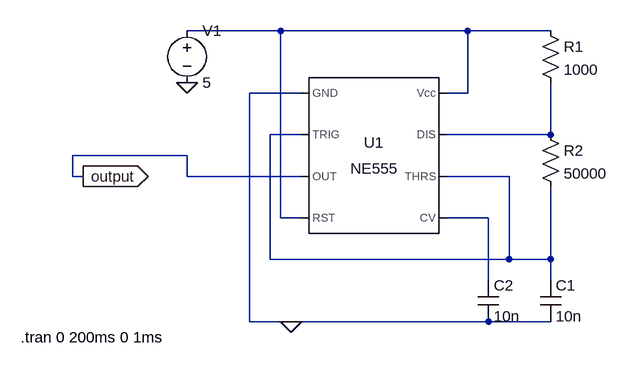
[diagram p0: schematic 1.2.asc]
1.2.asc, the LTspice schematic file:
Version 4
SHEET 1 880 680
WIRE 64 -32 -80 -32
WIRE 352 -32 64 -32
WIRE 480 -32 352 -32
WIRE 96 64 16 64
WIRE 352 64 352 -32
WIRE 352 64 320 64
WIRE 96 128 48 128
WIRE 480 128 480 48
WIRE 480 128 320 128
WIRE -80 160 -256 160
WIRE -256 192 -256 160
WIRE -240 192 -256 192
WIRE -80 192 -80 160
WIRE 96 192 -80 192
WIRE 416 192 320 192
WIRE 64 256 64 -32
WIRE 96 256 64 256
WIRE 384 256 320 256
WIRE 48 320 48 128
WIRE 416 320 416 192
WIRE 416 320 48 320
WIRE 480 320 480 208
WIRE 480 320 416 320
WIRE 384 352 384 256
WIRE 480 352 480 320
WIRE 16 416 16 64
WIRE 80 416 16 416
WIRE 384 416 80 416
WIRE 480 416 384 416
FLAG 80 416 0
FLAG -240 192 output
IOPIN -240 192 Out
FLAG -80 48 0
SYMBOL res 464 -48 R0
SYMATTR InstName R1
SYMATTR Value 1000
SYMBOL res 464 112 R0
SYMATTR InstName R2
SYMATTR Value 50000
SYMBOL cap 464 352 R0
SYMATTR InstName C1
SYMATTR Value 10n
SYMBOL cap 368 352 R0
SYMATTR InstName C2
SYMATTR Value 10n
SYMBOL Misc\\NE555 208 160 R0
SYMATTR InstName U1
SYMBOL voltage -80 -48 R0
SYMATTR InstName V1
SYMATTR Value 5
TEXT -336 440 Left 2 !.tran 0 200ms 0 1ms

The netlist it stands for:
* 1.2.asc
R1 N001 N003 1000
R2 N003 N002 50000
C1 N002 0 10n
C2 N004 0 10n
XU1 0 N002 output N001 N004 N002 N003 N001 NE555  ; pins GND TRIG OUT RST CV THRS DIS Vcc
V1 N001 0 5
.tran 0 200ms 0 1ms
.lib NE555.sub
.backanno
.end